# EAGLE design BlueCore TM 3-Multuimedia (EAGLE 7.2.0)
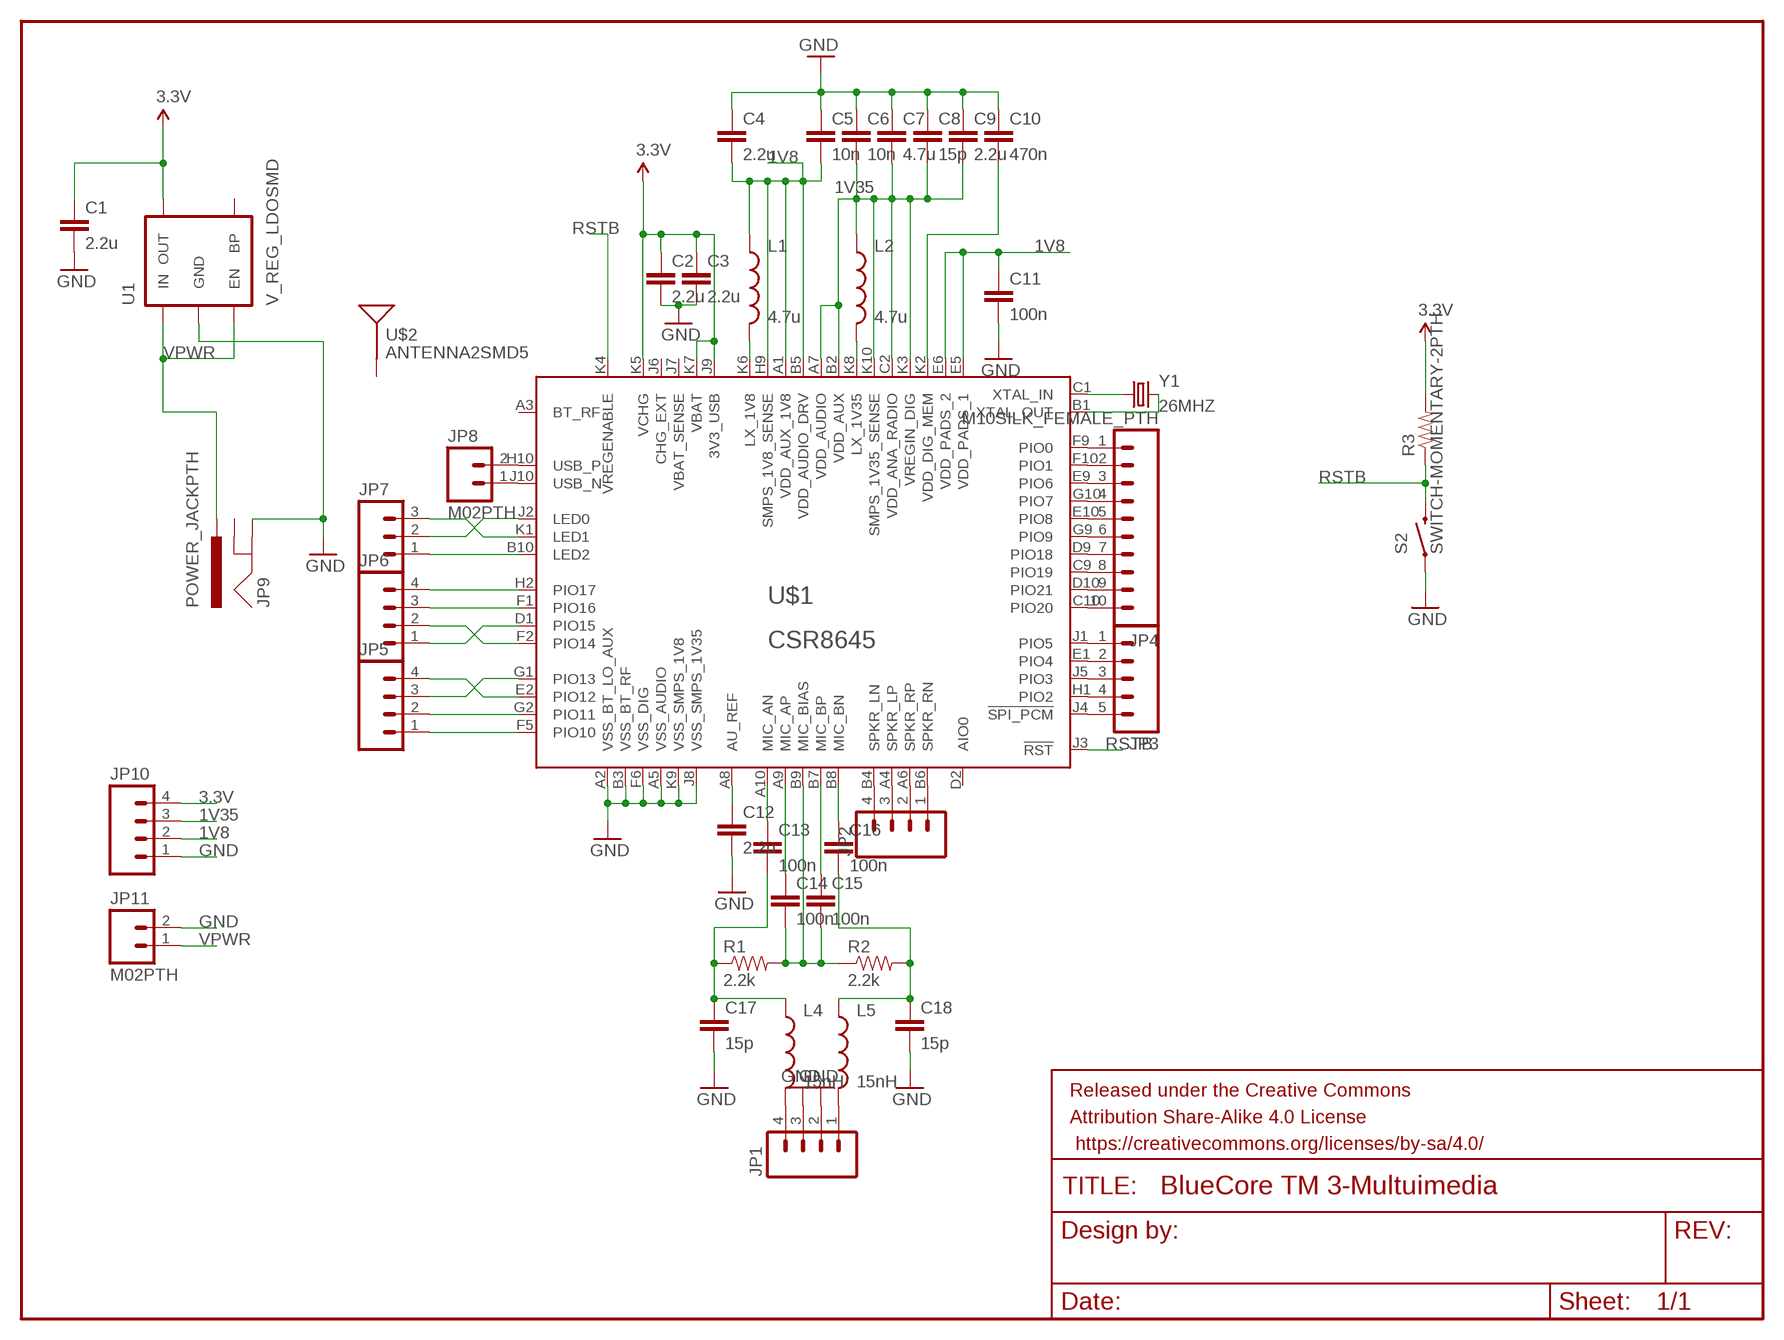
[diagram p0: schematic, sheet 1]

## Parts
C1  2.2u  CAPPTH  [CAP-PTH-SMALL]
C2  2.2u  CAPPTH  [CAP-PTH-SMALL]
C3  2.2u  CAPPTH  [CAP-PTH-SMALL]
C4  2.2u  CAPPTH  [CAP-PTH-SMALL]
C5  10n  CAPPTH  [CAP-PTH-SMALL]
C6  10n  CAPPTH  [CAP-PTH-SMALL]
C7  4.7u  CAPPTH  [CAP-PTH-SMALL]
C8  15p  CAPPTH  [CAP-PTH-SMALL]
C9  2.2u  CAPPTH  [CAP-PTH-SMALL]
C10  470n  CAPPTH  [CAP-PTH-SMALL]
C11  100n  CAPPTH  [CAP-PTH-SMALL]
C12  2.2u  CAPPTH  [CAP-PTH-SMALL]
C13  100n  CAPPTH  [CAP-PTH-SMALL]
C14  100n  CAPPTH  [CAP-PTH-SMALL]
C15  100n  CAPPTH  [CAP-PTH-SMALL]
C16  100n  CAPPTH  [CAP-PTH-SMALL]
C17  15p  CAPPTH  [CAP-PTH-SMALL]
C18  15p  CAPPTH  [CAP-PTH-SMALL]
FRAME1  FRAME-LETTER  [CREATIVE_COMMONS]
JP1  M04PTH  [1X04]
JP2  M04PTH  [1X04]
JP3  M05PTH  [1X05]
JP4  M10SILK_FEMALE_PTH  [1X10]
JP5  M04PTH  [1X04]
JP6  M04PTH  [1X04]
JP7  M03PTH  [1X03]
JP8  M02PTH  [1X02]
JP9  POWER_JACKPTH  [POWER_JACK_PTH]
JP10  M04PTH  [1X04]
JP11  M02PTH  [1X02]
L1  4.7u  INDUCTOR0805  [0805]
L2  4.7u  INDUCTOR0805  [0805]
L4  15nH  INDUCTOR0805  [0805]
L5  15nH  INDUCTOR0805  [0805]
R1  2.2k  RESISTOR0805-RES  [0805]
R2  2.2k  RESISTOR0805-RES  [0805]
R3  RESISTOR0805-RES  [0805]
S2  SWITCH-MOMENTARY-2PTH  [TACTILE-PTH]
U1  V_REG_LDOSMD  [SOT23-5]
U$1  CSR8645  [VFBGA68]
U$2  ANTENNA2SMD5  [ANTENNA-CHIP5]
Y1  26MHZ  CRYSTALHC49US  [HC49US]

## Nets
1V8: C4.2 C5.2 C11.1 JP10.2 L1.1 U$1.A1(VDD_AUX_1V8) U$1.B5(VDD_AUDIO_DRV) U$1.E5(VDD_PADS_1) U$1.E6(VDD_PADS_2) U$1.H9(SMPS_1V8_SENSE)
1V35: C6.2 C7.2 C8.2 C9.2 JP10.3 L2.1 U$1.A7(VDD_AUDIO) U$1.B2(VDD_AUX) U$1.C2(VDD_ANA_RADIO) U$1.K3(VREGIN_DIG) U$1.K10(SMPS_1V35_SENSE)
3.3V: C1.1 C2.1 C3.1 JP10.4 R3.2 U1.5(OUT) U$1.J9(3V3_USB) U$1.K5(VCHG) U$1.K7(VBAT)
GND: C1.2 C2.2 C3.2 C4.1 C5.1 C6.1 C7.1 C8.1 C9.1 C10.1 C11.2 C12.2 C17.2 C18.2 JP1.2 JP1.3 JP9.GND JP10.1 JP11.2 S2.1 U1.2(GND) U$1.A2(VSS_BT_LO_AUX) U$1.A5(VSS_AUDIO) U$1.B3(VSS_BT_RF) U$1.F6(VSS_DIG) U$1.J8(VSS_SMPS_1V35) U$1.K9(VSS_SMPS_1V8)
N$1: JP1.4 L4.2
N$2: JP4.1 U$1.F9(PIO0)
N$3: L1.2 U$1.K6(LX_1V8)
N$4: L2.2 U$1.K8(LX_1V35)
N$5: U$1.C1(XTAL_IN) Y1.1
N$6: C10.2 U$1.K2(VDD_DIG_MEM)
N$7: U$1.B1(XTAL_OUT) Y1.2
N$8: C12.1 U$1.A8(AU_REF)
N$9: JP1.1 L5.2
N$10: JP2.1 U$1.B6(SPKR_RN)
N$11: C13.2 C17.1 L4.1 R1.1
N$12: JP2.2 U$1.A6(SPKR_RP)
N$13: C14.2 C15.2 R1.2 R2.1 U$1.B9(MIC_BIAS)
N$14: C13.1 U$1.A10(MIC_AN)
N$15: C14.1 U$1.A9(MIC_AP)
N$16: C15.1 U$1.B7(MIC_BP)
N$17: C16.1 U$1.B8(MIC_BN)
N$18: C16.2 C18.1 L5.1 R2.2
N$19: JP2.3 U$1.A4(SPKR_LP)
N$20: JP2.4 U$1.B4(SPKR_LN)
N$21: JP4.2 U$1.F10(PIO1)
N$22: JP4.3 U$1.E9(PIO6)
N$23: JP4.4 U$1.G10(PIO7)
N$24: JP4.5 U$1.E10(PIO8)
N$25: JP4.6 U$1.G9(PIO9)
N$26: JP4.7 U$1.D9(PIO18)
N$27: JP4.8 U$1.C9(PIO19)
N$28: JP4.9 U$1.D10(PIO21)
N$29: JP4.10 U$1.C10(PIO20)
N$30: JP3.1 U$1.J1(PIO5)
N$31: JP3.2 U$1.E1(PIO4)
N$32: JP3.3 U$1.J5(PIO3)
N$33: JP3.4 U$1.H1(PIO2)
N$34: JP3.5 U$1.J4(!SPI_PCM)
N$35: JP5.1 U$1.F5(PIO10)
N$36: JP5.2 U$1.G2(PIO11)
N$37: JP5.4 U$1.E2(PIO12)
N$38: JP5.3 U$1.G1(PIO13)
N$39: JP6.1 U$1.D1(PIO15)
N$40: JP6.2 U$1.F2(PIO14)
N$41: JP6.3 U$1.F1(PIO16)
N$42: JP6.4 U$1.H2(PIO17)
N$43: JP7.1 U$1.B10(LED2)
N$44: JP7.3 U$1.K1(LED1)
N$45: JP7.2 U$1.J2(LED0)
N$46: JP8.1 U$1.J10(USB_N)
N$47: JP8.2 U$1.H10(USB_P)
RSTB: R3.1 S2.3 U$1.J3(!RST) U$1.K4(VREGENABLE)
VPWR: JP9.PWR JP11.1 U1.1(IN) U1.3(EN)
Unconnected: JP9.GNDBREAK U1.4(BP) U$1.A3(BT_RF) U$1.D2(AIO0) U$1.J6(CHG_EXT) U$1.J7(VBAT_SENSE) U$2.FEED(SIGNAL)

## Library data of the parts
C1-C18 = SparkFun-Passives:CAP: Capacitor Standard 0603 ceramic capacitor, and 0.1" leaded capacitor.
FRAME1 = SparkFun-Aesthetics:FRAME-LETTER: Schematic Frame Standard 8.5x11 US Letter frame
JP1 JP2 JP5 JP6 JP10 = SparkFun-Connectors:M04: Header 4 Standard 4-pin 0.1" header. Use with straight break away headers (SKU : PRT-00116), right angle break away headers (PRT-00553), swiss pins (PRT-00743), machine pins (PRT-00117), and female headers (PRT-00115). Molex polarized connector foot print use with SKU : PRT-08231 with associated crimp pins and housings. 1MM SMD Version SKU: PRT-10208
JP3 = SparkFun-Connectors:M05: Header 5 Standard 5-pin 0.1" header. Use with straight break away headers (SKU : PRT-00116), right angle break away headers (PRT-00553), swiss pins (PRT-00743), machine pins (PRT-00117), and female headers (PRT-00115). Molex polarized connector foot print use with SKU : PRT-08230 with associated crimp pins and housings.
JP4 = SparkFun-Connectors:M10: Header 10 Standard 10-pin 0.1" header. Use with straight break away headers (SKU : PRT-00116), right angle break away headers (PRT-00553), swiss pins (PRT-00743), machine pins (PRT-00117), and female headers (PRT-00115).; PROD_ID: CONN-11563
JP7 = SparkFun-Connectors:M03: Header 3 Standard 3-pin 0.1" header. Use with straight break away headers (SKU : PRT-00116), right angle break away headers (PRT-00553), swiss pins (PRT-00743), machine pins (PRT-00117), and female headers (PRT-00115). Molex polarized connector foot print use with SKU : PRT-08232 with associated crimp pins and housings.
JP8 JP11 = SparkFun-Connectors:M02: Standard 2-pin 0.1" header. Use with - straight break away headers ( PRT-00116) - right angle break away headers (PRT-00553) - swiss pins (PRT-00743) - machine pins (PRT-00117) - female headers (PRT-00115) Molex polarized connector foot print use with: PRT-08233 with associated crimp pins and housings. 2.54_SCREWTERM for use with PRT-10571. 3.5mm Screw Terminal footprints for PRT-08084 5mm Screw Terminal footprints for use with PRT-08432
JP9 = SparkFun-Connectors:POWER_JACK: Power Jack This is the standard 5.5mm barrel jack for power. The PTH is the most common, proven, reliable, footprint. The Slot footprint only works if the mill layer is transmitted to the PCB fab house so be warned. Mating wall wart : TOL-00298 (and others); PROD_ID: CONN-08197
L1 L2 L4 L5 = SparkFun-Passives:INDUCTOR: Inductors Basic Inductor/Choke - 0603 and 1206. Footprints are not proven and vary greatly between part numbers. SRN6045- 33uH, 20% 1.4A SDR0403-560KL - 56uH, 10%, 500mA RMS/740mA peak
R1-R3 = SparkFun-Resistors:RESISTOR: Resistor Basic schematic elements and footprints for 0603, 1206, and PTH resistors.
S2 = SparkFun-Electromechanical:SWITCH-MOMENTARY-2: Various NO switches- pushbuttons, reed, etc
U1 = SparkFun-PowerIC:V_REG_LDO: Voltage Regulator LDO Standard 150mA LDO voltage regulator in SOT-23 layout. Micrel part MIC5205. BP (by-pass) pin is used to lower output noise with 470pF cap.
U$1 = SparkFun-DigitalIC:CSR8645
U$2 = SparkFun-RF:ANTENNA2: Chip antenna Single endded antenna. Common with smaller chip antennas. CHIP4 package is the GPS Chip Antenna SKU: GPS-08418. CHIP5 package is 2.4GHz chip antenna SKU: WRL-00144.
Y1 = SparkFun-FreqCtrl:CRYSTAL: Various standard crystals. Proven footprints.

## Board
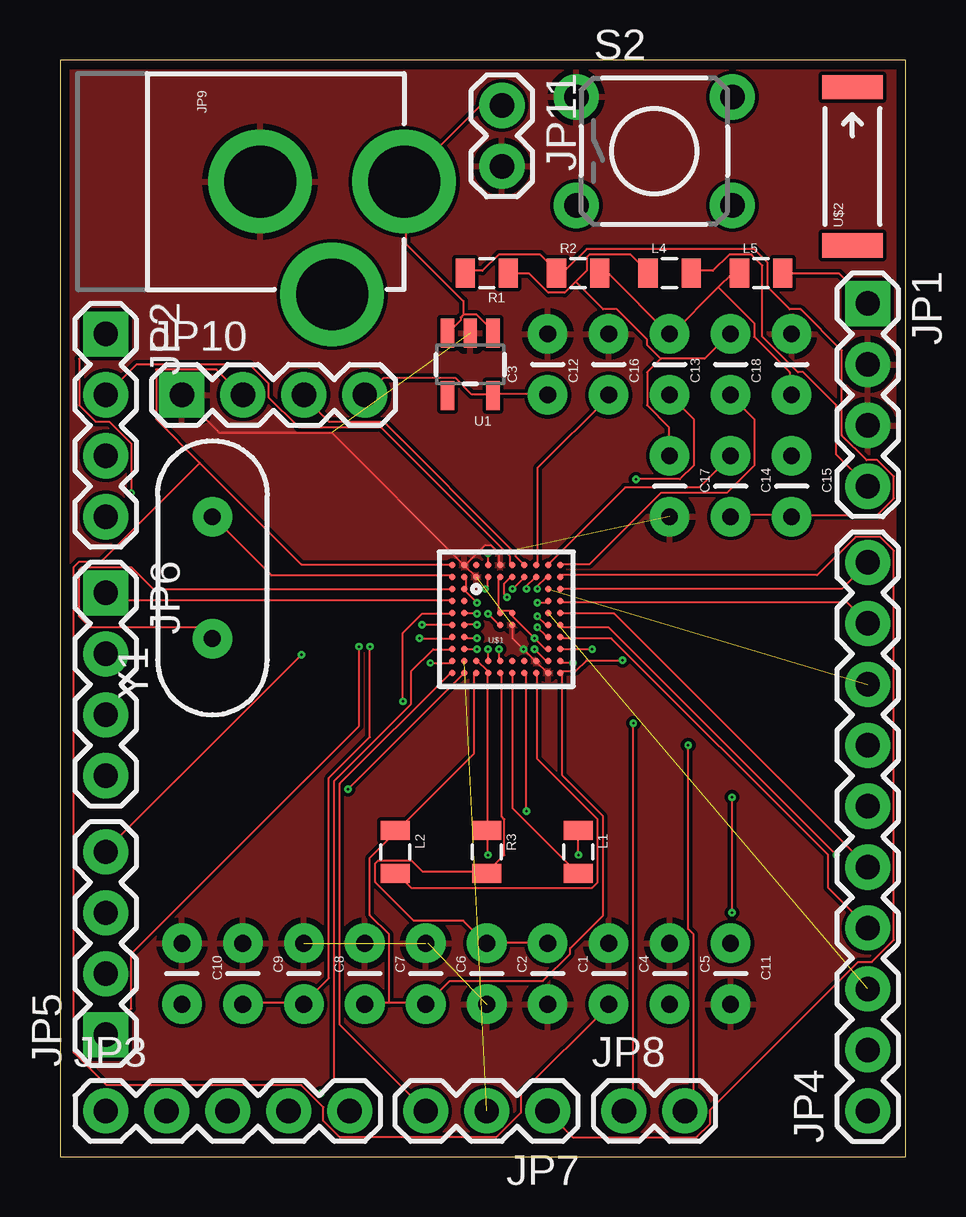
[diagram p1: board, top side]
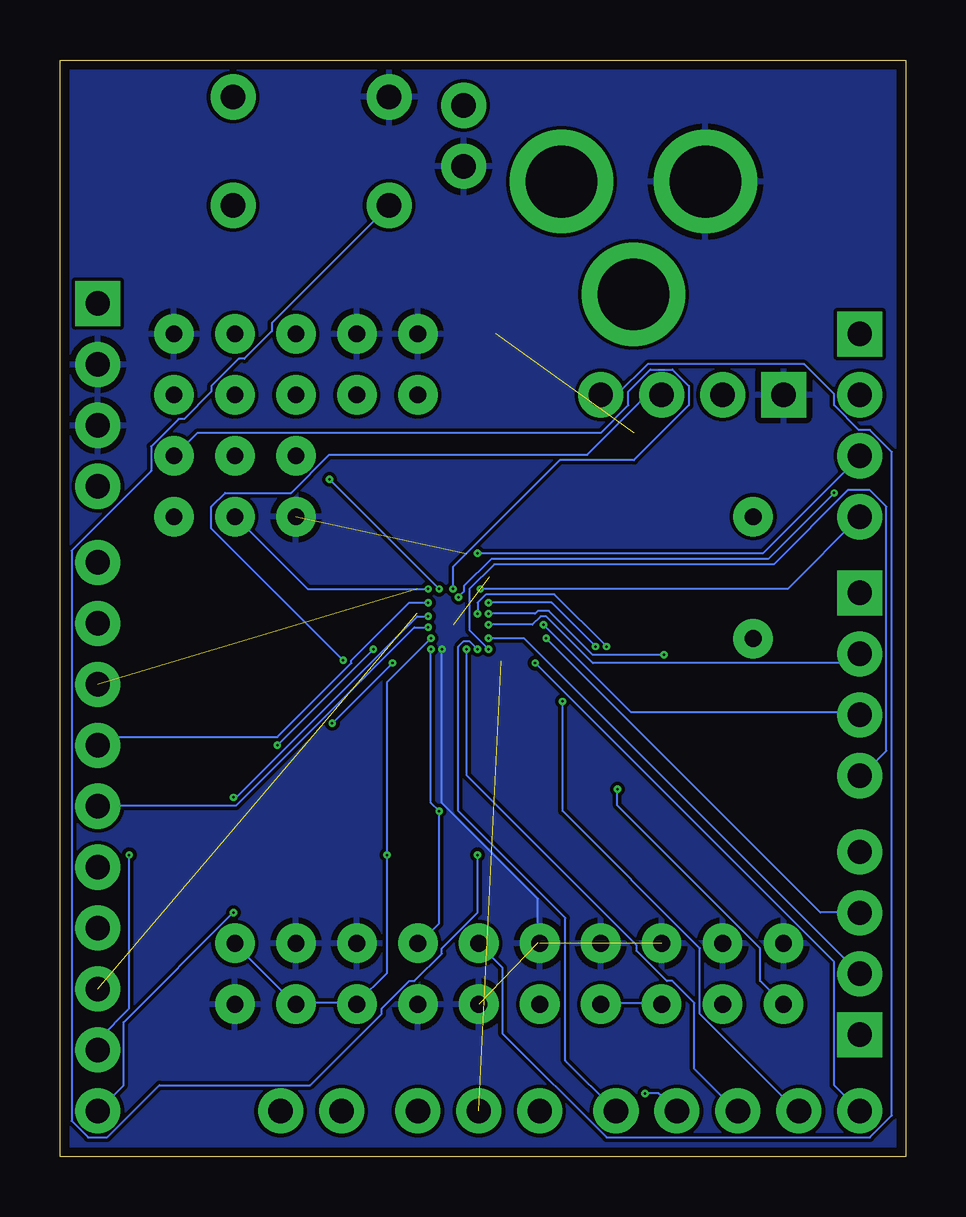
[diagram p2: board, bottom side, seen from below]

Size 35.23 x 45.71 mm. Coordinates in mm from the lower left corner, seen from the top.
Outline: 0,0 35.23,0 35.23,45.71 0,45.71 0,0
Copper layers (1*16): Top 0.0356mm / dielectric 1.5011mm / Bottom 0.0356mm
Design rules "oshpark-2layer *": minimum track width 3mil, minimum drill 4mil, track to track 6mil, track to pad 3mil, pad to pad 6mil, via to via 3mil, smd to smd 6mil, copper to edge 15mil, drill to drill 6mil, minimum pad ring 7mil, minimum via ring 4mil, stop-mask expansion 4mil, vias tented up to drill 0mil, thermal gap 10mil

### Footprints (pad centres in the part's own frame; a part is rotated, then mirrored left to right if it is on the bottom)
CAP-PTH-SMALL = drill 0.7 pad 1.651: 1 0,0; 2 2.54,0
1X04 = drill 1.016 pad 1.88 square: 1 0,0 | drill 1.016 pad 1.88: 2 2.54,0; 3 5.08,0; 4 7.62,0
1X05 = drill 1.016 pad 1.88: 1 0,0; 2 2.54,0; 3 5.08,0; 4 7.62,0; 5 10.16,0
1X10 = drill 1.016 pad 1.88: 1 0,0; 2 2.54,0; 3 5.08,0; 4 7.62,0; 5 10.16,0; 6 12.7,0; 7 15.24,0; 8 17.78,0; 9 20.32,0; 10 22.86,0
1X03 = drill 1.016 pad 1.88: 1 0,0; 2 2.54,0; 3 5.08,0
1X02 = drill 1.016 pad 1.88: 1 0,0; 2 2.54,0
POWER_JACK_PTH = drill 2.997 pad 4.318: GND 0,7.7; GNDBREAK 4.7,10.7; PWR 0,13.7
0805 = smd 0.8 x 1.2: 1 -0.9,0; 2 0.9,0
TACTILE-PTH = drill 1.016 pad 1.88: 1 -3.251,2.261; 2 3.251,2.261; 3 -3.251,-2.261; 4 3.251,-2.261
SOT23-5 = smd 0.55 x 1.2: 1 -0.95,-1.3; 2 0,-1.3; 3 0.95,-1.3; 4 0.95,1.3; 5 -0.95,1.3
VFBGA68 = smd 0.275 x 0.275: A1 -2.25,2.25; A2 -1.75,2.25; A3 -1.25,2.25; A4 -0.75,2.25; A5 -0.25,2.25; A6 0.25,2.25; A7 0.75,2.25; A8 1.25,2.25; A9 1.75,2.25; A10 2.25,2.25; B1 -2.25,1.75; B2 -1.75,1.75; B3 -1.25,1.75; B4 -0.75,1.75; B5 -0.25,1.75; B6 0.25,1.75; B7 0.75,1.75; B8 1.25,1.75; B9 1.75,1.75; B10 2.25,1.75; C1 -2.25,1.25; C2 -1.75,1.25; C9 1.75,1.25; C10 2.25,1.25; D1 -2.25,0.75; D2 -1.75,0.75; D9 1.75,0.75; D10 2.25,0.75; E1 -2.25,0.25; E2 -1.75,0.25; E5 -0.25,0.25; E6 0.25,0.25; E9 1.75,0.25; E10 2.25,0.25; F1 -2.25,-0.25; F2 -1.75,-0.25; F5 -0.25,-0.25; F6 0.25,-0.25; F9 1.75,-0.25; F10 2.25,-0.25; G1 -2.25,-0.75; G2 -1.75,-0.75; G9 1.75,-0.75; G10 2.25,-0.75; H1 -2.25,-1.25; H2 -1.75,-1.25; H9 1.75,-1.25; H10 2.25,-1.25; J1 -2.25,-1.75; J2 -1.75,-1.75; J3 -1.25,-1.75; J4 -0.75,-1.75; J5 -0.25,-1.75; J6 0.25,-1.75; J7 0.75,-1.75; J8 1.25,-1.75; J9 1.75,-1.75; J10 2.25,-1.75; K1 -2.25,-2.25; K2 -1.75,-2.25; K3 -1.25,-2.25; K4 -0.75,-2.25; K5 -0.25,-2.25; K6 0.25,-2.25; K7 0.75,-2.25; K8 1.25,-2.25; K9 1.75,-2.25; K10 2.25,-2.25
ANTENNA-CHIP5 = smd 1.016 x 2.54: FEED -3.302,0; NC 3.302,0
HC49US = drill 0.7 pad 1.651: 1 -2.54,0; 2 2.54,0

### Placement (x,y rotation side)
C1  20.32,8.89 270 top
C2  17.78,8.89 270 top
C3  20.32,31.75 90 top
C4  22.86,8.89 270 top
C5  25.4,8.89 270 top
C6  15.24,8.89 270 top
C7  12.7,8.89 270 top
C8  10.16,8.89 270 top
C9  7.62,8.89 270 top
C10  5.08,8.89 270 top
C11  27.94,8.89 270 top
C12  22.86,31.75 90 top
C13  27.94,31.75 90 top
C14  27.94,29.21 270 top
C15  30.48,29.21 270 top
C16  25.4,31.75 90 top
C17  25.4,29.21 270 top
C18  30.48,31.75 90 top
FRAME1  120.65,87.63 0 top  (outside the outline)
JP1  33.66,35.56 270 top
JP2  1.91,34.29 270 top
JP3  1.91,1.91 0 top
JP4  33.66,1.91 90 top
JP5  1.91,5.08 90 top
JP6  1.91,23.5 270 top
JP7  20.32,1.91 180 top
JP8  23.5,1.91 0 top
JP9  0.64,40.64 270 top
JP10  5.08,31.75 0 top
JP11  18.41,43.81 270 top
L1  21.59,12.7 270 top
L2  13.97,12.7 270 top
L4  25.4,36.83 0 top
L5  29.21,36.83 0 top
R1  17.78,36.83 180 top
R2  21.59,36.83 0 top
R3  17.78,12.7 270 top
S2  24.77,41.91 0 top
U1  17.09,33.02 180 top
U$1  18.59,22.4 0 top
U$2  33.02,41.27 90 top
Y1  6.35,24.13 90 top

### Tracks (layer width: path | path; a pad name or v marks a point on that pad's centre or on a via)
1V8  (via drill 0.1)
  Top 0.076: 5.83,28.92 4,30.75 4,32.8 6.51,32.8 7.54,31.77 JP10.2 | 5.83,28.92 10.06,24.69 16.23,24.69 U$1.A1 | U$1.H9 20.23,21.14 v19.77,21.6 18.75,22.63 U$1.E6 18.75,22.75 18.4,22.75 U$1.E5 18.29,22.75 18.29,24.12 U$1.B5 | v21.6,12.57 21.6,13.49 L1.1 | 5.83,28.92 1.71,24.8 0.8,24.8 0.57,24.57 0.57,4.34 1.94,2.97 10.06,2.97 10.97,2.06 10.97,1.49 11.66,0.8 18.17,0.8 19.2,1.83 19.2,2.63 22.86,6.29 C4.2
  Bottom 0.076: 22.86,6.4 21.6,7.66 v21.6,12.57 21.6,19.77 v19.77,21.6 | 22.86,6.4 25.38,6.4 C5.2 25.49,6.4 27.89,8.8 C11.1 | 22.86,6.4 C4.2
1V35  (via drill 0.1)
  Top 0.076: U$1.B2 16.92,24.12 16.92,23.66 U$1.C2 16.92,23.55 v17.37,23.09 | v12.92,21.26 12.92,17.49 11.2,15.77 11.2,7.43 10.17,6.4 C8.2 10.06,6.4 7.66,6.4 C9.2 | U$1.A7 19.32,24.69 18.97,25.03 18.97,25.15 13.49,30.63 11.2,30.63 10.17,31.66 JP10.3 | U$1.K3 17.26,20.12 17.26,16.8 14.06,13.6 L2.1 13.95,13.49 12.92,12.46 12.92,10.06 13.72,9.26 13.72,6.4 | 13.72,6.4 15.2,6.4 C6.2 15.32,6.4 16.23,7.32 20.12,7.32 21.26,8.46 21.26,8.69 22.63,10.06 22.63,14.17 20.92,15.89 20.92,20.12 U$1.K10 20.92,20.23 21.49,20.23 21.95,20.69 v23.43,20.69 | 13.72,6.4 12.8,6.4 C7.2
  Bottom 0.076: v17.37,23.09 14.74,23.09 v12.92,21.26 | v23.43,20.69 28.92,26.18 28.92,27.09 28.35,27.66 25.6,27.66 24,29.26 13.26,29.26 10.86,31.66 10.17,31.66 JP10.3 | C8.2 10.17,6.4 12.69,6.4 C7.2
3.3V  (via drill 0.1)
  Top 0.076: C3.1 20.23,31.77 18.06,31.77 U1.5 17.95,31.77 17.14,31.77 16.46,32.46 13.49,32.46 12.8,31.77 JP10.4 | U$1.K5 18.4,20.12 18.4,14.17 18.52,14.06 18.52,12.57 17.83,11.89 R3.2 17.72,11.89 15.09,11.89 14.63,12.34 13.26,12.34 13.14,12.23 13.14,11.43 14.74,9.83 16.8,9.83 17.72,8.91 C2.1 17.83,8.91 20.23,8.91 C1.1 | v19.43,14.4 19.43,20.12 U$1.K7 | v19.77,21.14 20.23,20.69 U$1.J9
  Bottom 0.076: C1.1 20.23,8.91 19.43,9.72 v19.43,14.4 19.77,14.74 v19.77,21.14 | JP10.4 12.69,31.77 12,31.77 10.74,33.03 4.23,33.03 2.97,31.77 2.97,31.32 1.94,30.29 1.49,30.29 0.57,29.38 0.57,1.71 1.49,0.8 12.46,0.8 16.8,5.14 16.8,7.89 17.72,8.8 C2.1
GND  (via drill 0.1)  (6 unrouted)
  Top 0.076: U$1.K9 20.23,20.23 19.89,20.57 U$1.J8 19.77,20.69 v19.32,21.14 18.86,21.6 18.86,22.06 U$1.F6 | U$1.A2 16.92,24.57 17.26,24.23 U$1.B3 | U$1.A5 18.29,24.69 18.29,25.15 17.95,25.49 17.72,25.49 16.92,24.69 U$1.A2 | U$1.A2 16.8,24.69 11.32,30.18 6.63,30.18 5.14,31.66 JP10.1
  Bottom 0.076: v19.32,21.14 19.32,14.74 15.32,10.74 15.32,8.91 C6.1
  pour Top: 0,45.72 35.56,45.72 35.56,0 0,0
  pour Bottom: 0,45.72 35.56,45.72 35.56,0 0,0
N$1
  Top 0.076: L4.2 26.4,36.92 27.2,36.92 27.89,37.6 28.8,37.6 29.26,37.15 29.26,34.18 30.75,32.69 30.98,32.69 32.35,31.32 32.35,29.26 33.6,28 JP1.4
N$2  (via drill 0.1)
  Top 0.076: v19.89,22.52 20.23,22.17 U$1.F9 | v28,10.17 v28,14.97
  Bottom 0.076: v19.89,22.52 20.34,22.52 27.89,14.97 v28,14.97 | v28,10.17 32.58,5.6 32.58,2.97 33.6,1.94 JP4.1
N$3
  Top 0.076: U$1.K6 18.86,20.12 18.86,14.52 21.49,11.89 L1.2
N$4
  Top 0.076: U$1.K8 19.89,20.12 19.89,16.57 22.4,14.06 22.4,11.43 22.17,11.2 14.63,11.2 14.06,11.77 L2.2
N$5
  Top 0.076: U$1.C1 16.23,23.66 3.89,23.66 2.97,24.57 0.91,24.57 0.8,24.46 0.8,22.52 1.26,22.06 5.83,22.06 6.29,21.6 Y1.1
N$6  (via drill 0.1)
  Top 0.076: v12,15.32 16.8,20.12 U$1.K2
  Bottom 0.076: v12,15.32 12,14.63 6.06,8.69 6.06,7.32 5.14,6.4 C10.2
N$7
  Top 0.076: U$1.B1 16.23,24.23 8.8,24.23 6.4,26.63 Y1.2
N$8
  Top 0.076: U$1.A8 19.89,24.69 19.89,28.69 22.86,31.66 C12.1
N$9
  Top 0.076: L5.2 30.18,36.8 32.46,36.8 33.6,35.66 JP1.1
N$10  (via drill 0.1)
  Top 0.076: v18.63,23.32 18.52,23.43 18.52,23.89 18.75,24.12 U$1.B6 | v2.97,27.66 2.97,29.72 2.06,30.63 1.49,30.63 0.8,31.32 0.8,33.26 1.83,34.29 JP2.1
  Bottom 0.076: v18.63,23.32 18.4,23.55 18.4,23.77 17.26,24.92 5.71,24.92 v2.97,27.66
N$11
  Top 0.076: 21.49,36.46 21.95,36.92 21.95,37.49 22.06,37.6 23.77,37.6 24.46,36.92 L4.1 | 21.49,36.46 21.03,36.01 20.34,36.01 19.55,36.8 18.75,36.8 R1.1 | 21.49,36.46 22.63,35.32 23.2,35.32 24.46,34.06 24.46,33.83 25.03,33.26 | 25.03,33.26 26.86,33.26 27.89,34.29 C13.2 | 25.03,33.26 24.46,32.69 24.46,31.32 25.38,30.4 25.38,29.26 C17.1
N$12
  Top 0.076: U$1.A6 18.75,24.69 18.75,25.03 13.37,30.4 9.94,30.4 8.69,31.66 8.69,32.23 7.89,33.03 3.2,33.03 1.94,31.77 JP2.2
N$13  (via drill 0.1)
  Top 0.076: v19.89,23.66 19.89,23.77 20.23,24.12 U$1.B9 | R1.2 16.92,36.92 17.6,36.92 18.29,37.6 20,37.6 20.69,36.92 R2.1 20.8,36.92 21.03,36.92 21.95,37.83 28.92,37.83 29.49,37.26 29.49,36.23 30.4,35.32 30.86,35.32 32.58,33.6 32.58,30.06 33.6,29.03 34.06,29.03 34.75,28.35 34.75,27.43 34.06,26.75 30.52,26.75 C15.2 30.4,26.75 28,26.75 C14.2
  Bottom 0.076: v19.89,23.66 24.92,23.66 27.89,26.63 C14.2
N$14
  Top 0.076: U$1.A10 20.92,24.69 22.06,24.69 25.03,27.66 27.77,27.66 28.92,28.8 28.92,30.75 28,31.66 C13.1
N$15
  Top 0.076: U$1.A9 20.34,24.69 23.55,27.89 26.63,27.89 27.89,29.15 C14.1
N$16  (via drill 0.1)
  Top 0.076: v18.86,23.66 19.32,24.12 U$1.B7
  Bottom 0.076: v18.86,23.66 18.86,24.57 14.4,29.03 11.32,29.03 9.03,31.32 9.03,32.12 9.72,32.8 10.63,32.8 11.54,31.89 11.54,31.32 12.69,30.18 29.49,30.18 30.4,29.26 C15.1
N$17  (via drill 0.1)
  Top 0.076: v19.43,23.66 19.43,23.77 19.77,24.12 U$1.B8 | v24,28.23 25.83,28.23 26.4,28.8 26.4,30.75 C16.1
  Bottom 0.076: v24,28.23 v19.43,23.66
N$18
  Top 0.076: R2.2 22.52,36.8 22.86,36.8 25.38,34.29 C16.2 25.49,34.29 27.43,36.23 | 27.43,36.23 28,36.8 28.23,36.8 L5.1 | 27.43,36.23 28.92,34.75 28.92,34.18 30.4,32.69 30.4,31.77 C18.1
N$19  (via drill 0.1)
  Top 0.076: v17.83,25.15 17.83,24.69 U$1.A4
  Bottom 0.076: v17.83,25.15 5.94,25.15 1.94,29.15 JP2.3
N$20  (via drill 0.1)
  Top 0.076: v17.72,23.66 17.83,23.77 17.83,24.12 U$1.B4
  Bottom 0.076: v17.72,23.66 4.92,23.66 JP2.4
N$21  (via drill 0.1)
  Top 0.076: v32.35,12.57 22.86,22.06 20.92,22.06 U$1.F10
  Bottom 0.076: v32.35,12.57 32.35,6.17 33.6,4.92 33.6,4.46 JP4.2
N$22  (1 unrouted)
N$23
  Top 0.076: U$1.G10 20.92,21.6 22.97,21.6 32,12.57 32,11.2 33.6,9.6 JP4.4
N$24
  Top 0.076: JP4.5 23.09,22.63 20.92,22.63 U$1.E10
N$25  (via drill 0.1)
  Top 0.076: v19.89,22.06 20.23,21.72 U$1.G9
  Bottom 0.076: v19.89,22.06 20.46,22.06 27.89,14.63 33.6,14.63 JP4.6
N$26  (via drill 0.1)
  Top 0.076: v19.89,23.09 20.23,23.09 U$1.D9
  Bottom 0.076: v19.89,23.09 20.69,23.09 23.09,20.69 23.09,20.57 26.18,17.49 33.26,17.49 33.6,17.14 JP4.7
N$27  (1 unrouted)
N$28
  Top 0.076: U$1.D10 20.92,23.09 32.8,23.09 33.6,22.29 JP4.9
N$29
  Top 0.076: U$1.C10 20.92,23.66 32.58,23.66 33.6,24.69 JP4.10
N$30  (via drill 0.1)
  Top 0.076: v15.43,20.57 16.23,20.57 U$1.J1
  Bottom 0.076: v15.43,20.57 2.97,8.12 2.97,2.97 JP3.1
N$31  (via drill 0.1)
  Top 0.076: v14.29,18.97 14.29,21.83 15.09,22.63 16.23,22.63 U$1.E1
  Bottom 0.076: v14.29,18.97 14.29,14.4 8.57,8.69 8.57,5.94 4.46,1.83 JP3.2
N$32  (via drill 0.1)
  Top 0.076: v18.29,21.14 18.29,20.69 U$1.J5
  Bottom 0.076: v18.29,21.14 18.29,15.89 11.2,8.8 11.2,8.57 9.94,7.32 9.72,7.32 8.8,6.4 8.8,3.66 7.09,1.94 JP3.3
N$33  (via drill 0.1)
  Top 0.076: v10.86,2.63 11.43,3.2 11.43,15.66 14.63,18.86 14.63,20.23 15.54,21.14 16.23,21.14 U$1.H1
  Bottom 0.076: v10.86,2.63 10.29,2.63 9.6,1.94 JP3.4
N$34  (via drill 0.1)
  Top 0.076: v17.83,21.14 17.83,20.69 U$1.J4
  Bottom 0.076: v17.83,21.14 18.17,21.49 18.4,21.49 18.63,21.26 18.63,14.4 14.17,9.94 14.17,4 12.12,1.94 JP3.5
N$35  (via drill 0.1)
  Top 0.076: v17.83,22.63 18.29,22.17 U$1.F5 | v12.46,21.26 12.46,17.95 2.97,8.46 2.97,6.17 1.94,5.14 JP5.1
  Bottom 0.076: v17.83,22.63 17.83,23.09 17.49,23.43 14.63,23.43 v12.46,21.26
N$36  (via drill 0.1)
  Top 0.076: v17.37,21.6 16.92,21.6 U$1.G2
  Bottom 0.076: v17.37,21.6 15.89,21.6 JP5.2
N$37  (via drill 0.1)
  Top 0.076: v17.37,22.63 16.92,22.63 U$1.E2 | v10.06,20.92 1.94,12.8 JP5.4
  Bottom 0.076: v17.37,22.63 15.43,22.63 15.32,22.75 14.86,22.75 13.03,20.92 v10.06,20.92
N$38  (via drill 0.1)
  Top 0.076: v14.97,21.6 16.23,21.6 U$1.G1
  Bottom 0.076: v14.97,21.6 3.54,10.17 1.94,10.17 JP5.3
N$39
  Top 0.076: U$1.D1 16.23,23.2 2.17,23.2 1.94,23.43 JP6.1
N$40  (via drill 0.1)
  Top 0.076: v17.37,22.17 16.92,22.17 U$1.F2
  Bottom 0.076: v17.37,22.17 15.54,22.17 15.2,22.52 14.97,22.52 13.03,20.57 2.29,20.57 JP6.2
N$41  (via drill 0.1)
  Top 0.076: v15.09,22.17 16.23,22.17 U$1.F1
  Bottom 0.076: v15.09,22.17 11.43,18.52 1.94,18.52 JP6.3
N$42  (via drill 0.1)
  Top 0.076: v17.37,21.14 16.92,21.14 U$1.H2
  Bottom 0.076: v17.37,21.14 18.17,21.95 18.17,23.66 17.14,24.69 5.49,24.69 2.4,27.77 1.49,27.77 0.8,27.09 0.8,16.92 1.83,15.89 JP6.4
N$43
  Top 0.076: U$1.B10 20.92,24.23 31.55,24.23 33.15,25.83 34.18,25.83 34.75,25.26 34.75,9.03 33.83,8.12 33.26,8.12 27.09,1.94 27.09,1.37 26.52,0.8 21.37,0.8 20.34,1.83 JP7.1
N$44
  Top 0.076: JP7.3 11.66,5.49 11.66,15.54 16.23,20.12 U$1.K1
N$45  (1 unrouted)
N$46  (via drill 0.1)
  Top 0.076: v21.37,20.57 20.92,20.57 U$1.J10 | v23.89,18.06 23.89,2.29 23.55,1.94 JP8.1
  Bottom 0.076: v23.89,18.06 v21.37,20.57
N$47  (via drill 0.1)
  Top 0.076: v22.17,21.14 20.92,21.14 U$1.H10 | v26.18,17.14 26.18,9.49 26.4,9.26 26.4,2.29 26.06,1.94 JP8.2
  Bottom 0.076: v26.18,17.14 v22.17,21.14
RSTB  (via drill 0.1)
  Top 0.076: U$1.J3 17.37,20.69 17.83,20.23 U$1.K4 17.83,20.12 17.83,13.6 R3.1 17.83,13.49 v17.83,12.57
  Bottom 0.076: v17.83,12.57 17.83,10.17 19.32,8.69 19.32,8.46 20.46,7.32 20.69,7.32 21.83,6.17 21.83,5.94 24.8,2.97 31.09,2.97 33.26,0.8 34.06,0.8 34.75,1.49 34.75,25.26 31.43,28.57 31.43,29.6 30.29,30.75 30.06,30.75 28.92,31.89 28.92,32.12 27.77,33.26 27.55,33.26 26.4,34.4 26.4,34.75 21.6,39.55 S2.3
VPWR
  Top 0.076: 16.8,35.09 16.69,34.98 16.69,34.86 16.23,34.4 U1.3 | 16.8,35.09 17.37,35.09 18.06,34.4 U1.1 | 16.8,35.09 16.8,35.66 14.4,38.06 14.4,40.58 JP9.PWR 14.4,40.69 17.49,43.78 18.4,43.78 JP11.1